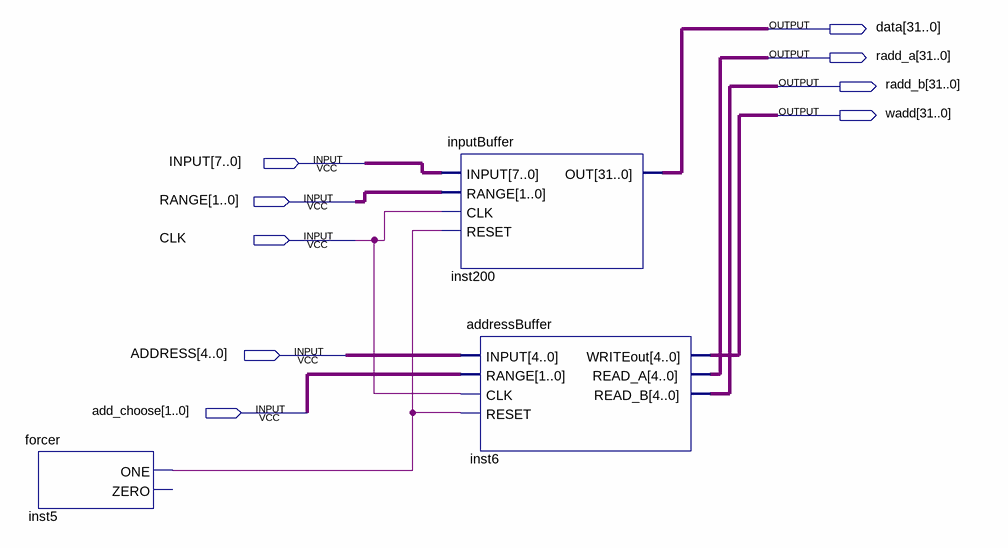
[diagram p0: schematic sheet]
// Quartus schematic type1.bdf as structural Verilog: 3 symbols, 9 pins
module type1 (
  input  [7:0] INPUT,
  input  [1:0] RANGE,
  input  CLK,
  input  [4:0] ADDRESS,
  input  [1:0] add_choose,
  output [31:0] data,
  output [31:0] radd_a,
  output [31:0] radd_b,
  output [31:0] wadd
);

  wire inst5_one;

  forcer inst5 (.ONE(inst5_one));  // open: ZERO
  inputBuffer inst200 (.INPUT(INPUT), .RANGE(RANGE), .CLK(CLK), .RESET(inst5_one), .OUT(data));
  addressBuffer inst6 (
    .INPUT(ADDRESS), .RANGE(add_choose), .CLK(CLK), .RESET(inst5_one), .WRITEout(wadd), .READ_A(radd_a),
    .READ_B(radd_b));
endmodule
